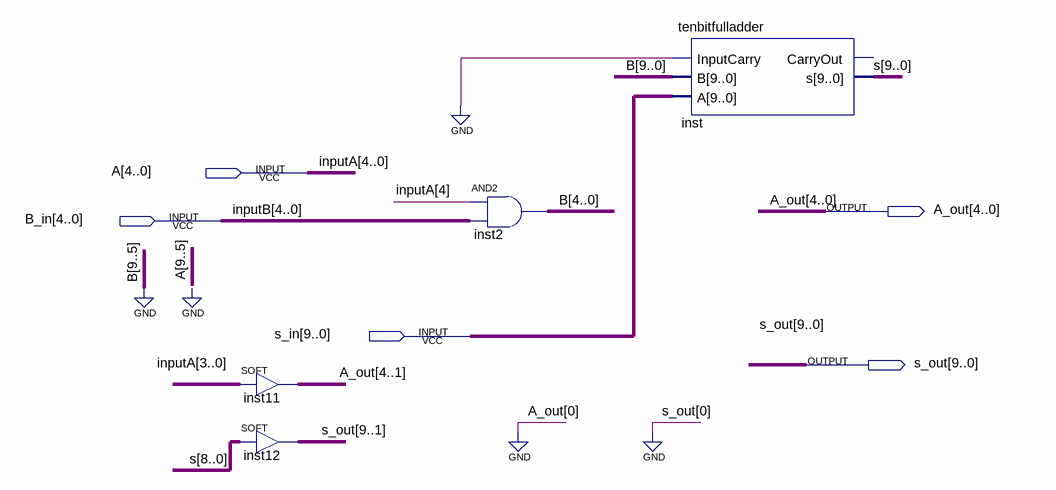
[diagram p0: schematic sheet]
// Quartus schematic sum.bdf as structural Verilog: 4 symbols, 5 pins
module sum (
  input  [4:0] A,
  input  [4:0] B_in,
  input  [9:0] s_in,
  output [4:0] A_out,
  output [9:0] s_out
);

  wire [4:0] B;
  wire [9:0] s;

  SOFT inst11[3:0] (.IN(A[3:0]), .OUT(A_out[4:1]));
  SOFT inst12[8:0] (.IN(s[8:0]), .OUT(s_out[9:1]));
  assign B = {5{A[4]}} & B_in;  // AND2 inst2, 5 bits wide
  tenbitfulladder inst (.InputCarry(1'b0), .B({{5{1'b0}}, B}), .A(s_in), .s(s));  // open: CarryOut

  assign A_out[0] = 1'b0;
  assign s_out[0] = 1'b0;

  // Other names for the same wires on the sheet: inputA[4:0] = A; inputB[4:0] = B_in
endmodule
